# EAGLE design STM32-DIPDAP-v1.0.0 (EAGLE 7.7.0)
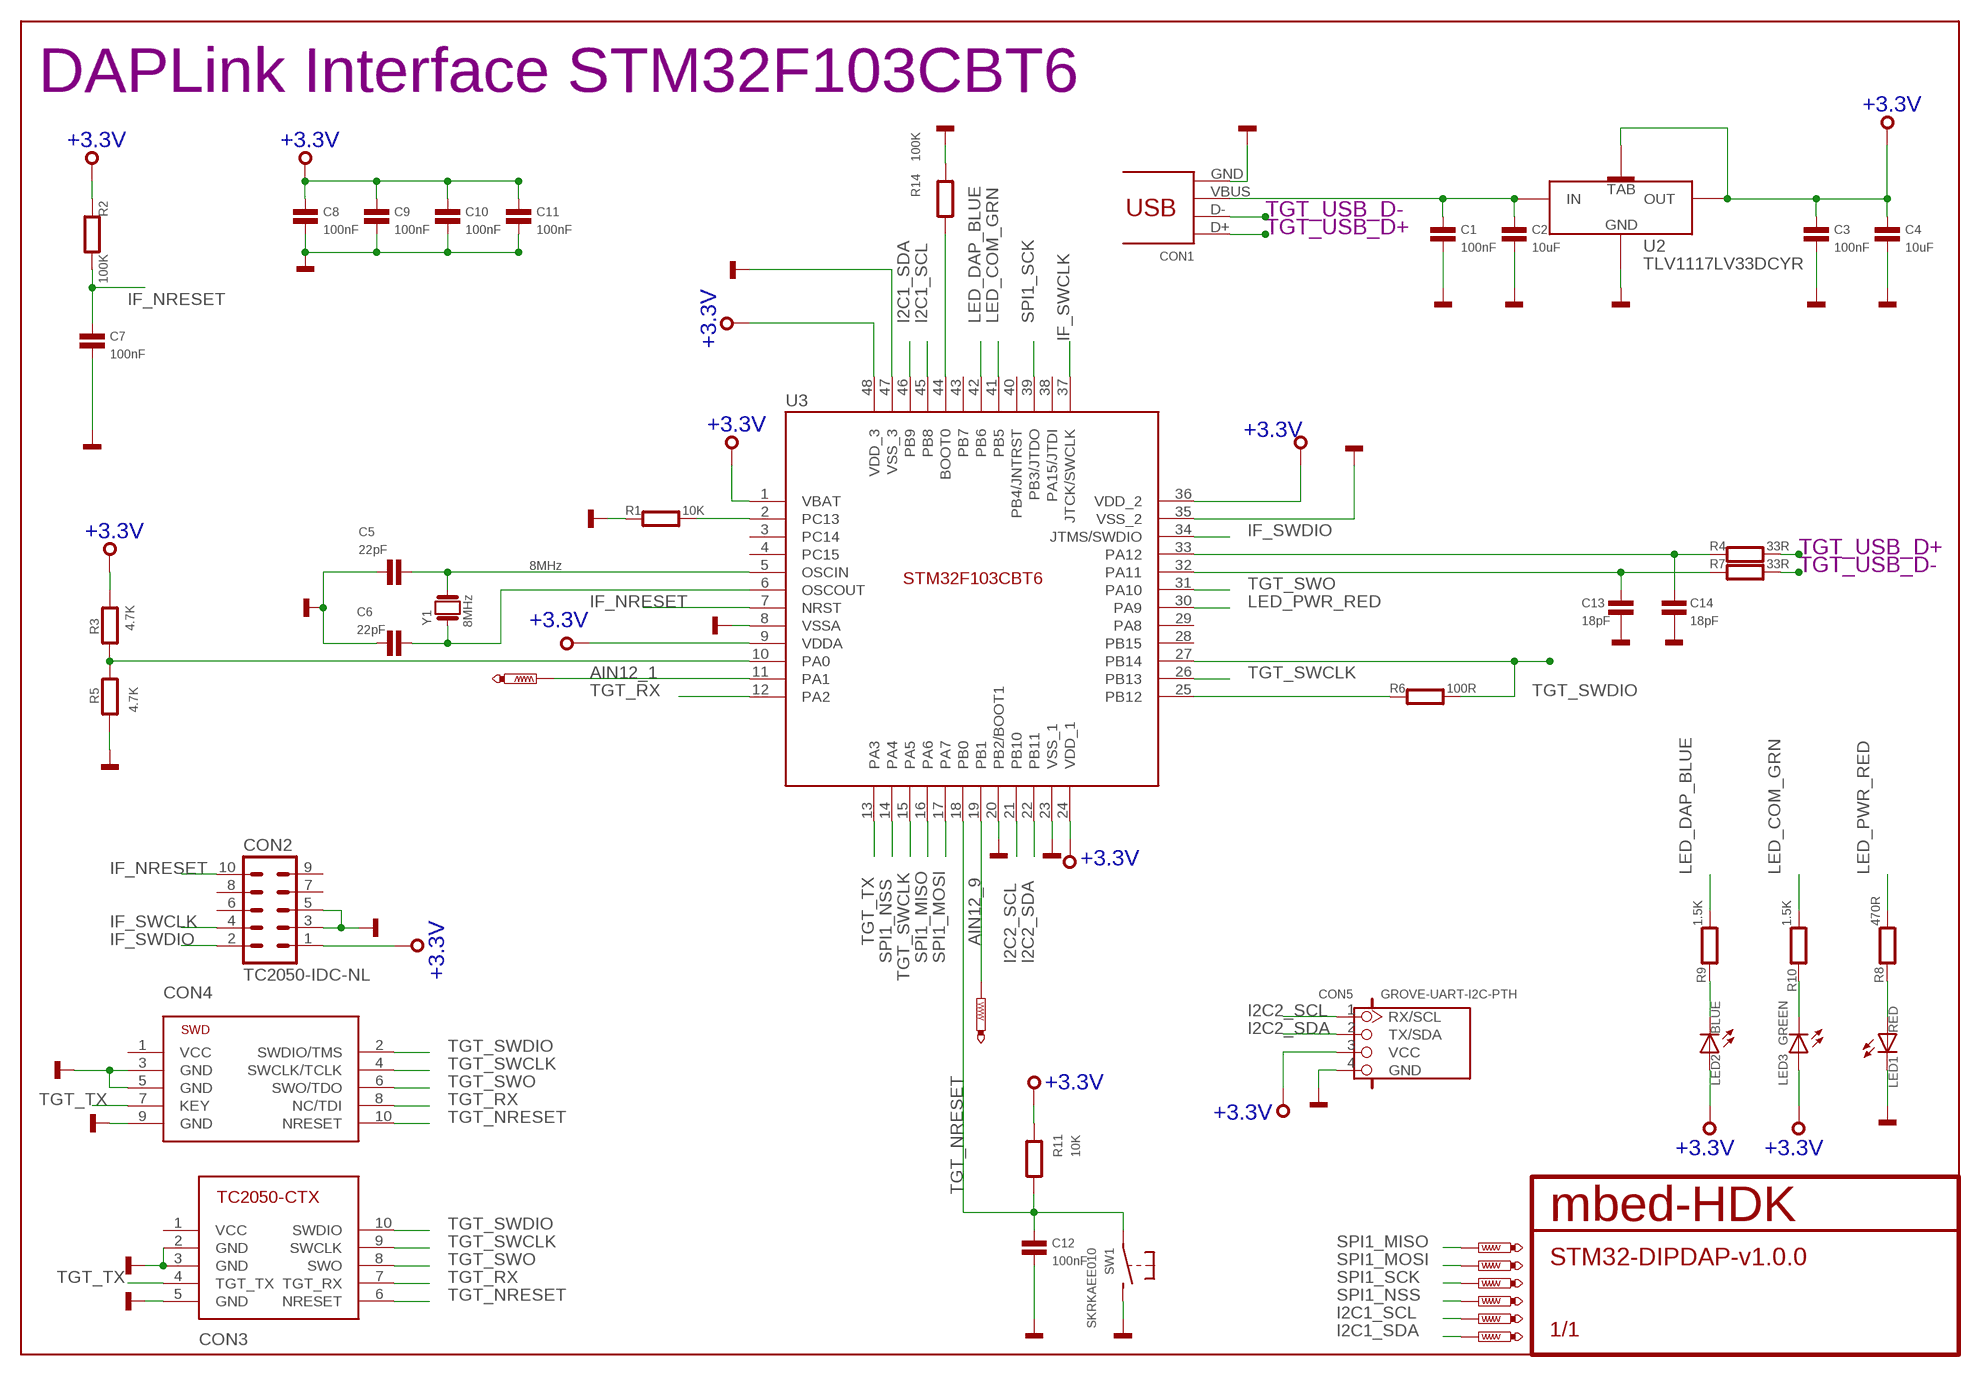
[diagram p0: schematic, sheet 1]

## Parts
C1  100nF  CAPACITOR0603  [0603]
C2  10uF  CAPACITOR0603  [0603]
C3  100nF  CAPACITOR0603  [0603]
C4  10uF  CAPACITOR0603  [0603]
C5  22pF  CAPACITOR0603  [0603]
C6  22pF  CAPACITOR0603  [0603]
C7  100nF  CAPACITOR0603  [0603]
C8  100nF  CAPACITOR0603  [0603]
C9  100nF  CAPACITOR0603  [0603]
C10  100nF  CAPACITOR0603  [0603]
C11  100nF  CAPACITOR0603  [0603]
C12  100nF  CAPACITOR0603  [0603]
C13  18pF  CAPACITOR0603  [0603]
C14  18pF  CAPACITOR0603  [0603]
CON1  47346-0001  [USB-MICRO-B-H]
CON2  TC2050-IDC-NL  [TC2050-IDC-NL]
CON3  TC-2050  [2X5_0.1"]
CON4  SWD-10-SMD  [SWD-10-SMD]
CON5  GROVE-UART-I2C-PTH  [HW4-2.0]
LED1  RED  SMD_LED0603  [CHIPLED_0603]
LED2  BLUE  SMD_LED0603  [CHIPLED_0603]
LED3  GREEN  SMD_LED0603  [CHIPLED_0603]
R1  10K  RESISTOR0603  [0603]
R2  100K  RESISTOR0603  [0603]
R3  4.7K  RESISTOR0603  [0603]
R4  33R  RESISTOR0603  [0603]
R5  4.7K  RESISTOR0603  [0603]
R6  100R  RESISTOR0603  [0603]
R7  33R  RESISTOR0603  [0603]
R8  470R  RESISTOR0603  [0603]
R9  1.5K  RESISTOR0603  [0603]
R10  1.5K  RESISTOR0603  [0603]
R11  10K  RESISTOR0603  [0603]
R14  100K  RESISTOR0603  [0603]
SW1  SKRKAEE010  [SKRKAEE010]
TP1  PTR1TP07R  [TP07R]
TP2  PTR1TP07R  [TP07R]
TP3  PTR1TP07R  [TP07R]
TP4  PTR1TP07R  [TP07R]
TP5  PTR1TP07R  [TP07R]
TP6  PTR1TP07R  [TP07R]
TP7  PTR1TP07R  [TP07R]
TP8  PTR1TP07R  [TP07R]
U2  TLV1117LV33DCYR  [SOT223]
U3  STM32F103CBT6  [LQFP48]
Y1  8MHz  GENERIC-CRYSTAL_2.5X2.0  [2.5X2.0]

## Nets
+3.3V: C3.1 C4.1 C8.1 C9.1 C10.1 C11.1 CON2.1 CON5.3(VCC) LED2.A LED3.A R2.1 R3.1 R11.1 U2.OUT(1)(OUT) U2.OUT(2)(TAB) U3.1(VBAT) U3.9(VDDA) U3.24(VDD_1) U3.36(VDD_2) U3.48(VDD_3)
AIN12_1: TP2.TP U3.11(PA1)
AIN12_9: TP1.TP U3.19(PB1)
GND: C1.2 C2.2 C3.2 C4.2 C5.2 C6.2 C7.2 C8.2 C9.2 C10.2 C11.2 C12.2 C13.2 C14.2 CON1.GND CON2.3 CON2.5 CON3.2(GND) CON3.3(GND) CON3.5(GND) CON4.3(GND) CON4.5(GND) CON4.9(GND) CON5.4(GND) LED1.C R1.1 R5.2 R14.1 SW1.P$2(S) U2.GND U3.8(VSSA) U3.20(PB2/BOOT1) U3.23(VSS_1) U3.35(VSS_2) U3.47(VSS_3)
I2C1_SCL: TP4.TP U3.45(PB8)
I2C1_SDA: TP3.TP U3.46(PB9)
I2C2_SCL: CON5.1(RX/SCL) U3.21(PB10)
I2C2_SDA: CON5.2(TX/SDA) U3.22(PB11)
IF_NRESET: C7.1 CON2.10 R2.2 U3.7(NRST)
IF_SWCLK: CON2.4 U3.37(JTCK/SWCLK)
IF_SWDIO: CON2.2 U3.34(JTMS/SWDIO)
LED_COM_GRN: R10.2 U3.41(PB5)
LED_DAP_BLUE: R9.2 U3.42(PB6)
LED_PWR_RED: R8.2 U3.30(PA9)
N$1: C1.1 C2.1 CON1.VBUS U2.IN
N$3: R14.2 U3.44(BOOT0)
N$4: R1.2 U3.2(PC13)
N$5: C6.1 U3.6(OSCOUT) Y1.1
N$6: C5.1 U3.5(OSCIN) Y1.3
N$8: R3.2 R5.1 U3.10(PA0)
N$11: LED1.A R8.1
N$12: R6.1 U3.25(PB12)
N$13: LED2.C R9.1
N$14: LED3.C R10.1
N$15: C14.1 R4.1 U3.33(PA12)
N$17: C13.1 R7.1 U3.32(PA11)
SPI1_MISO: TP8.TP U3.16(PA6)
SPI1_MOSI: TP7.TP U3.17(PA7)
SPI1_NSS: TP5.TP U3.14(PA4)
SPI1_SCK: TP6.TP U3.39(PB3/JTDO)
TGT_NRESET: C12.1 CON3.6(NRESET) CON4.10(NRESET) R11.2 SW1.P$1(P) U3.18(PB0)
TGT_RX: CON3.7(TGT_RX) CON4.8(NC/TDI) U3.12(PA2)
TGT_SWCLK: CON3.9(SWCLK) CON4.4(SWCLK/TCLK) U3.15(PA5) U3.26(PB13)
TGT_SWDIO: CON3.10(SWDIO) CON4.2(SWDIO/TMS) R6.2 U3.27(PB14)
TGT_SWO: CON3.8(SWO) CON4.6(SWO/TDO) U3.31(PA10)
TGT_TX: CON3.4(TGT_TX) CON4.7(KEY) U3.13(PA3)
TGT_USB_D+: CON1.D+ R4.2
TGT_USB_D-: CON1.D- R7.2
Unconnected: CON2.6 CON2.7 CON2.8 CON2.9 CON3.1(VCC) CON4.1(VCC) U3.3(PC14) U3.4(PC15) U3.28(PB15) U3.29(PA8) U3.38(PA15/JTDI) U3.40(PB4/JNTRST) U3.43(PB7)

## Notes on the sheet
- DAPLink Interface STM32F103CBT6
- 8MHz

## Library data of the parts
C1 C3 C7-C12 = mbed-HDK-RLCQ:CAPACITOR: Capacitor
C2 C4-C6 C13 C14 = mbed-HDK-RLC:CAPACITOR: Capacitor
CON1 = mbed-HDK-Connector:47346-0001: USB Receptacle Horizontal Micro Type B; MF: MOLEX; MFN: 47346-0001; OC-MOUSER: 538-47346-0001; OC-NEWARK: 1568026
CON2 = mbed-HDK-Connector:TC2050-IDC: Tag-Connect In Circuit Programming & Debug Cable 10 Pin
CON3 = mbed-HDK-Connector:TC-2050: 2.54mm pitch TC2050
CON4 = mbed-HDK-Connector:SWD-10: 2.54mm pitch 10-Pin Cortex Programming Header
CON5 = blackbriar:GROVE-UART-I2C-PTH
LED1-LED3 = mbed-HDK-Optical:SMD_LED: LED SMD, Colour Red; MF: Wurth Electronics Inc; MFN: 150060RS75000; OC-DIGIKEY: 732-4978-1-ND; OC-MOUSER: 710-150060RS75000; OC-NEWARK: 2322071
R1 R4 R6 R7 = mbed-HDK-RLC:RESISTOR: Resistor
R2 R3 R5 R8-R11 R14 = mbed-HDK-RLCQ:RESISTOR: Resistor
SW1 = mbed-HDK-Switch:SKRKAEE010: MOMENTARY SWITCH PUSH VERTICAL (SPST); MF: ALPS; MFN: SKRKAEE010; OC-MOUSER: 688-SKRKAE
TP1-TP8 = blackbriar:PTR1: TEST PIN
U2 = mbed-HDK-Power:TLV1117LV33DCYR: LDO Fixed Regulator 3.3v, 1A; MF: Texas Instruments; MFN: TLV1117LV33DCYR; OC-DIGIKEY: 296-28778-1-ND; OC-MOUSER: 595-TLV1117LV33DCYR; OC-NEWARK: 2323647
U3 = mbed-HDK-MF-ST:STM32F103CBT6: ARM® Cortex®-M3 STM32 F1 Microcontroller IC 32-Bit 72MHz 128KB (128K x 8) FLASH; MF: STMicroelectronics; MFN: STM32F103CBT6; OC-DIGIKEY: 497-6288-ND; OC-MOUSER: 511-STM32F103CBT6; OC-NEWARK: 11N8296
Y1 = mbed-HDK-Oscillator:GENERIC-CRYSTAL: GENERIC Crystal

## Board
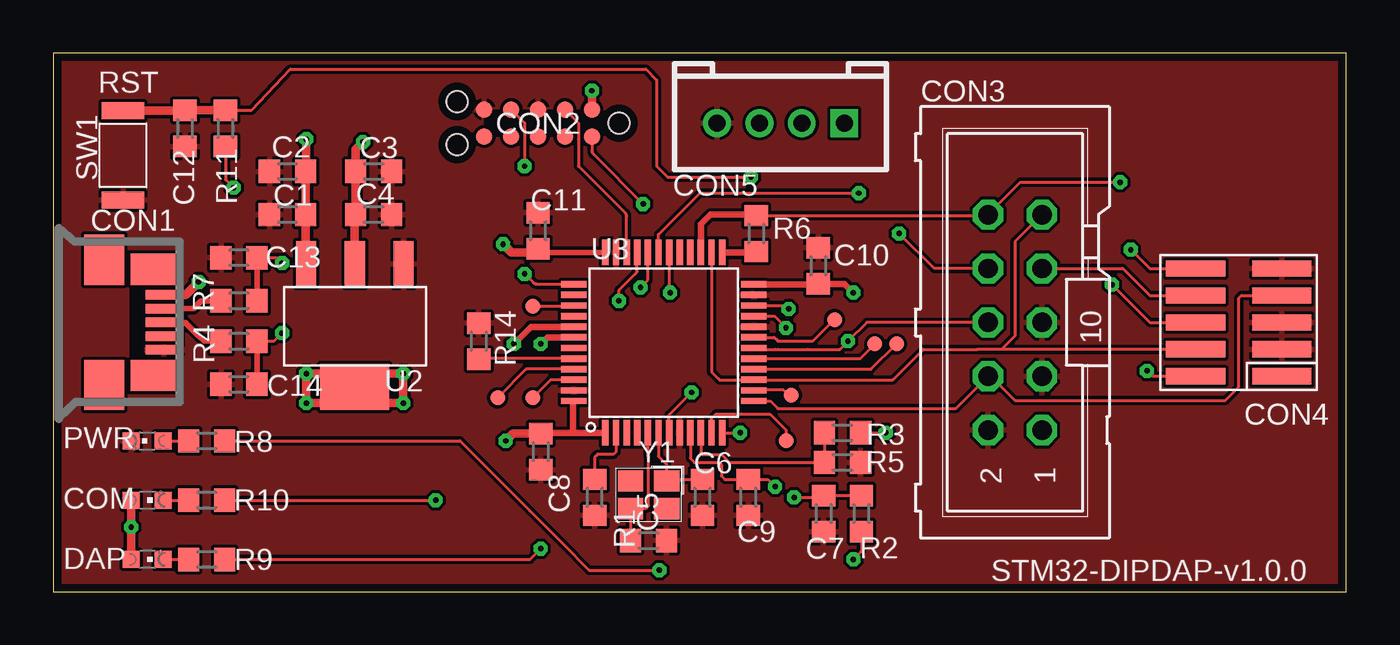
[diagram p1: board, top side]
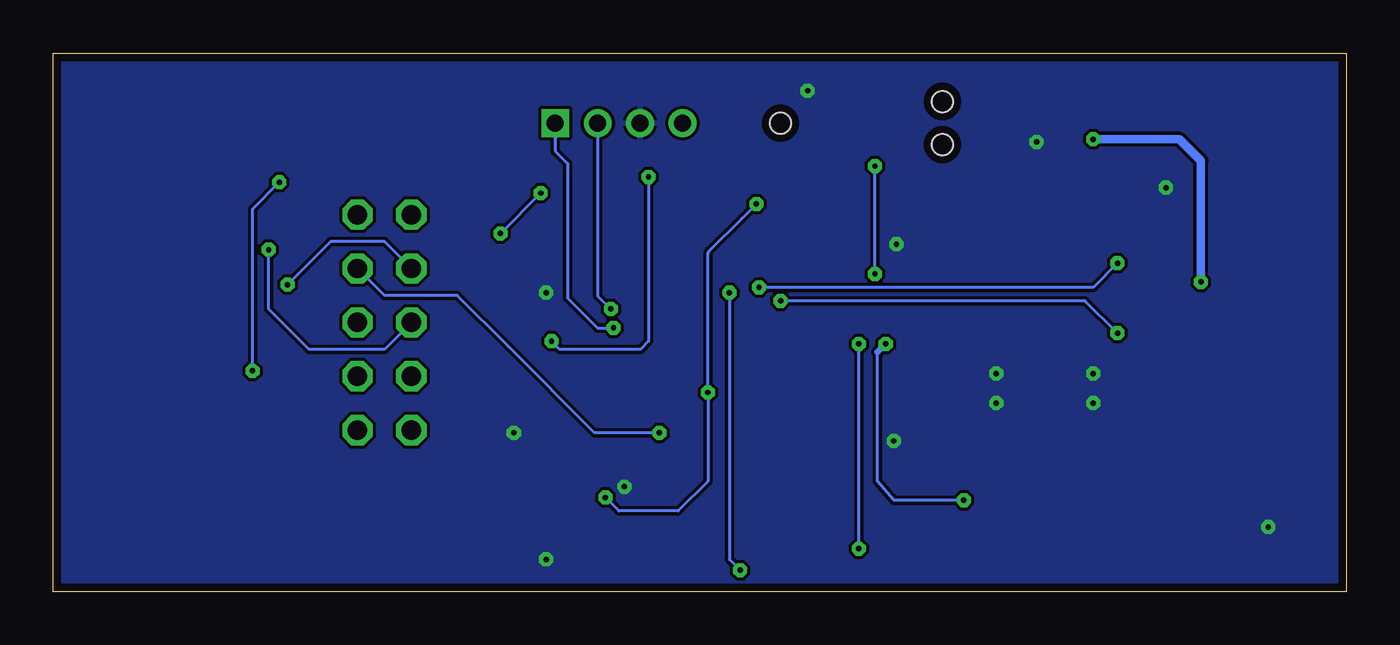
[diagram p2: board, bottom side, seen from below]

Size 60.96 x 25.4 mm. Coordinates in mm from the lower left corner, seen from the top.
Outline: 0,0 60.96,0 60.96,25.4 0,25.4 0,0
Copper layers ((1*16)): Top 0.035mm / dielectric 0.8mm / Bottom 0.035mm
Design rules "mbed-HDK-6-6-2-layer *": minimum track width 6mil, minimum drill 9mil, track to track 6mil, track to pad 6mil, pad to pad 6mil, via to via 6mil, smd to smd 6mil, copper to edge 15mil, drill to drill 8mil, minimum pad ring 10mil, minimum via ring 8mil, stop-mask expansion 4mil, vias tented up to drill 0mil, thermal gap 6mil

### Footprints (pad centres in the part's own frame; a part is rotated, then mirrored left to right if it is on the bottom)
0603 = smd 1 x 1.1: 1 -0.85,0; 2 0.85,0
USB-MICRO-B-H = smd 1.7 x 0.45: 4 2.8,-0.65; D+ 2.8,0; D- 2.8,0.65; GND 2.8,-1.3; VBUS 2.8,1.3 | smd 1.9 x 2.375: GND1 0,2.95; GND4 0,-2.95 | smd 2.1 x 1.475: GND2 2.3,2.5; GND3 2.3,-2.5
TC2050-IDC-NL = smd 0.787 x 0.787: 1 -2.54,-0.635; 2 -1.27,-0.635; 3 0,-0.635; 4 1.27,-0.635; 5 2.54,-0.635; 6 2.54,0.635; 7 1.27,0.635; 8 0,0.635; 9 -1.27,0.635; 10 -2.54,0.635 | hole 0.991: -3.81,0; 3.81,1.016; 3.81,-1.016
2X5_0.1" = drill 0.914 octagon: 1 -5.08,-1.27; 2 -5.08,1.27; 3 -2.54,-1.27; 4 -2.54,1.27; 5 0,-1.27; 6 0,1.27; 7 2.54,-1.27; 8 2.54,1.27; 9 5.08,-1.27; 10 5.08,1.27
SWD-10-SMD = smd 0.762 x 2.794: 1 0.381,-2.032; 2 0.381,2.032; 3 1.651,-2.032; 4 1.651,2.032; 5 2.921,-2.032; 6 2.921,2.032; 7 4.191,-2.032; 8 4.191,2.032; 9 5.461,-2.032; 10 5.461,2.032
HW4-2.0 = drill 0.8 pad 1.27 square: 1 -3,0 | drill 0.8 pad 1.27: 2 -1,0; 3 1,0; 4 3,0
CHIPLED_0603 = smd 0.8 x 0.8: A 0,-0.75; C 0,0.75
SKRKAEE010 = smd 0.8 x 2: P$1 -2.1,0; P$2 2.1,0
TP07R = smd 0.7 x 0.7: TP 0,0
SOT223 = smd 0.95 x 2.15: GND -2.3,-5.8; IN 2.3,-5.8; OUT(1) 0,-5.8 | smd 3.25 x 2.15: OUT(2) 0,0
LQFP48 = smd 0.3 x 1.2: 1 0,0; 2 0.5,0; 3 1,0; 4 1.5,0; 5 2,0; 6 2.5,0; 7 3,0; 8 3.5,0; 9 4,0; 10 4.5,0; 11 5,0; 12 5.5,0; 25 5.5,8.5; 26 5,8.5; 27 4.5,8.5; 28 4,8.5; 29 3.5,8.5; 30 3,8.5; 31 2.5,8.5; 32 2,8.5; 33 1.5,8.5; 34 1,8.5; 35 0.5,8.5; 36 0,8.5 | smd 1.2 x 0.3: 13 7,1.5; 14 7,2; 15 7,2.5; 16 7,3; 17 7,3.5; 18 7,4; 19 7,4.5; 20 7,5; 21 7,5.5; 22 7,6; 23 7,6.5; 24 7,7; 37 -1.5,7; 38 -1.5,6.5; 39 -1.5,6; 40 -1.5,5.5; 41 -1.5,5; 42 -1.5,4.5; 43 -1.5,4; 44 -1.5,3.5; 45 -1.5,3; 46 -1.5,2.5; 47 -1.5,2; 48 -1.5,1.5
2.5X2.0 = smd 1.2 x 1: 1 -0.85,-0.65; 2 0.85,-0.65; 3 0.85,0.65; 4 -0.85,0.65

### Placement (x,y rotation side)
C1  11.05,17.78 180 top
C2  11.05,19.81 180 top
C3  15.11,19.81 0 top
C4  15.11,17.78 0 top
C5  28.07,2.41 0 top
C6  30.61,4.44 270 top
C7  36.32,3.68 270 top
C8  22.99,6.6 270 top
C9  32.77,4.44 270 top
C10  36.07,15.37 90 top
C11  22.86,17.02 90 top
C12  6.22,21.84 270 top
C13  8.76,15.75 180 top
C14  8.76,9.78 180 top
CON1  2.41,12.7 0 top
CON2  22.86,22.1 180 top
CON3  45.34,12.7 90 top
CON4  55.88,9.78 90 top
CON5  34.29,22.1 180 top
LED1  4.45,7.11 90 top
LED2  4.45,1.52 270 top
LED3  4.45,4.32 270 top
R1  25.53,4.44 90 top
R2  38.1,3.68 90 top
R3  37.21,7.49 180 top
R4  8.76,11.81 180 top
R5  37.21,6.1 0 top
R6  33.15,16.89 90 top
R7  8.76,13.72 180 top
R8  7.24,7.11 0 top
R9  7.24,1.52 0 top
R10  7.24,4.32 0 top
R11  8.13,21.84 90 top
R14  20.07,11.81 270 top
SW1  3.3,20.57 270 top
TP1  36.83,12.83 0 top
TP2  34.54,7.11 0 top
TP3  22.61,9.14 0 top
TP4  20.95,9.14 0 top
TP5  34.8,9.27 0 top
TP6  22.61,13.46 0 top
TP7  38.73,11.68 0 top
TP8  39.75,11.68 0 top
U2  14.22,9.65 180 top
U3  26.04,7.49 0 top
Y1  28.07,4.57 180 top

### Tracks (layer width: path | path; a pad name or v marks a point on that pad's centre or on a via)
+3.3V  (via drill 0.25)
  Top 0.152: U3.9 30.04,6.29 30.23,6.1 31.37,6.1 31.5,5.97 31.5,5.46 31.62,5.33 31.66,5.29 C9.1 33.69,5.29 v34.04,4.95 | R2.1 38.1,1.9 v37.72,1.52 | 23.03,7.49 C8.1 | R11.1 8.13,19.43 v8.51,19.05 | R3.1 v39.24,7.49
  Top 0.254: U3.36 23.04,15.99 C11.1
  Top 0.305: U3.24 36.04,14.49 C10.1 37.3,14.52 v37.72,14.1 | 23.04,15.99 C11.1 | 23.03,7.49 24.51,7.49 | 24.51,7.49 U3.1 | U3.48 24.51,8.97 24.51,7.49
  Top 0.406: U2.OUT(1) 14.22,17.74 C4.1 C3.1 14.26,20.87 v14.61,21.21 | v11.94,10.29 v16.51,10.29 v16.51,8.89 v11.94,8.89 v11.94,10.29 | v11.94,10.29 13.59,10.29 U2.OUT(2) | CON2.1 v25.4,23.62 | LED3.A 3.69,3.06 v3.68,3.05 3.69,3.04 LED2.A | v21.34,7.11 21.68,7.45 C8.1 | 23.04,15.99 21.6,15.99 v21.21,16.38
  pour Bottom: 0,0 60.96,0 60.96,25.4 0,25.4
AIN12_1
  Top 0.152: U3.11 31.04,8.17 31.24,8.38 33.78,8.38 34.54,7.62 TP2.TP
AIN12_9
  Top 0.152: U3.19 33.98,11.99 34.16,11.81 35.81,11.81 TP1.TP
GND
  pour Top: 0,25.4 0,0 60.96,0 60.96,25.4
I2C1_SCL
  Top 0.152: U3.45 22.3,10.49 TP4.TP
I2C1_SDA
  Top 0.152: U3.46 23.45,9.99 TP3.TP
I2C2_SCL  (via drill 0.25)
  Top 0.152: U3.21 34,12.99 v34.54,12.45
  Bottom 0.152: CON5.1 37.29,20.78 36.7,20.19 36.7,14.35 36.7,13.84 35.56,12.7 35.31,12.45 v34.54,12.45
I2C2_SDA  (via drill 0.25)
  Top 0.152: U3.22 34.51,13.49 v34.67,13.33
  Bottom 0.152: CON5.2 35.29,13.95 v34.67,13.33
IF_NRESET  (via drill 0.25)
  Top 0.152: U3.7 29.04,8.33 v30.1,9.4 | v34.92,4.44 36.23,4.44 C7.1 R2.2 | CON2.10 25.4,20.81 arc45 25.47,20.63 v27.81,18.29
  Bottom 0.152: v34.92,4.44 34.29,3.81 31.5,3.81 30.1,5.21 v30.1,9.4 30.1,15.9 arc45 30.02,16.08 28.5,17.6 v27.81,18.29
IF_SWCLK  (via drill 0.25)
  Top 0.152: CON2.4 22.23,22.1 v22.23,20.07 | U3.37 22.82,14.49 arc-45 22.64,14.57 v22.23,14.99
  Bottom 0.152: v22.23,14.99 v22.23,20.07
IF_SWDIO
  Top 0.152: CON2.2 24.77,22.1 24.77,21.34 24.77,20.07 26.96,17.87 arc-45 27.04,17.69 U3.34
LED_COM_GRN  (via drill 0.25)
  Top 0.152: R10.2 v18.03,4.32
  Top 0.305: U3.41 22.53,12.49 v21.72,11.68
  Bottom 0.152: v18.03,4.32 21.34,4.32 22.1,5.21 22.1,11.3
  Bottom 0.305: 22.1,11.3 v21.72,11.68
LED_DAP_BLUE  (via drill 0.25)
  Top 0.152: R9.2 22.48,1.52 v22.99,2.03
  Top 0.305: U3.42 23.3,11.99 v22.99,11.68
  Bottom 0.152: v22.99,2.03 v22.99,11.68
LED_PWR_RED  (via drill 0.25)
  Top 0.152: R8.2 19.18,7.11 22.48,3.81 24,2.29 25.27,1.02 v28.57,1.02 | U3.30 29.04,14.4 v29.08,14.1
  Bottom 0.152: v29.08,14.1 29.08,1.52 v28.57,1.02
N$1  (via drill 0.25)
  Top 0.406: CON1.VBUS 6.25,14 v6.86,14.6 | 11.94,15.44 U2.IN 11.9,15.48 C1.1 C2.1 11.94,20.23 v11.94,21.34
  Bottom 0.406: v6.86,14.6 6.86,20.32 7.87,21.34 v11.94,21.34
N$3
  Top 0.152: U3.44 20.1,10.99
  Top 0.305: 20.1,10.99 R14.2
N$4
  Top 0.152: U3.2 26.54,6.6 26.42,6.48 25.65,6.48 25.53,6.35 R1.2
N$5
  Top 0.152: U3.6 28.54,6.39 28.83,6.1 28.92,6.01 Y1.1 28.99,5.29 C6.1
N$6
  Top 0.152: C5.1 Y1.3 27.23,3.94 27.94,3.94 28.07,4.06 28.07,6.35 28.04,6.38 U3.5
N$8
  Top 0.152: U3.10 30.54,6.55 30.61,6.48 31.5,6.48 31.88,6.1 35.43,6.1 R5.1 R3.2
N$11
  Top 0.152: LED1.A R8.1
N$12
  Top 0.305: U3.25 33.1,15.99 R6.1
N$13
  Top 0.152: LED2.C R9.1
N$14
  Top 0.152: LED3.C R10.1
N$15  (via drill 0.25)
  Top 0.152: R4.1 10.41,11.81 v10.79,12.19 | v26.67,13.72 26.67,14.22 27.43,14.99 27.54,15.09 U3.33
  Top 0.254: C14.1 R4.1
  Bottom 0.152: v10.79,12.19 12.32,13.72 v26.67,13.72
N$17  (via drill 0.25)
  Top 0.152: C13.1 10.54,15.75 v10.79,15.49 | v27.69,14.35 28.04,14.7 U3.32
  Top 0.254: R7.1 C13.1
  Bottom 0.152: v10.79,15.49 11.94,14.35 v27.69,14.35
SPI1_MISO
  Top 0.152: U3.16 38.56,10.49 TP8.TP
SPI1_MOSI
  Top 0.152: U3.17 35.36,10.99 36.63,10.99 38.04,10.99 TP7.TP
SPI1_NSS
  Top 0.152: TP5.TP 34.67,9.27 34.42,9.52 33.07,9.52 U3.14
SPI1_SCK
  Top 0.152: TP6.TP 24.5,13.46 U3.39
TGT_NRESET  (via drill 0.25)
  Top 0.152: R11.2 9.06,22.69 9.36,22.69 11.18,24.64 27.94,24.64 28.45,24.13 28.45,20.07 28.96,19.56 v32.89,19.56 | CON3.6 38.35,12.7 v37.47,11.81 37.08,11.43 35.56,11.43 34.16,11.43 34.04,11.43 33.1,11.43 U3.18 | v50.8,16.13 51.69,15.24 CON4.10
  Top 0.406: SW1.P$1 6.2,22.67 C12.1 R11.2
  Bottom 0.152: v32.89,19.56 32.89,12.45 32.89,11.81 33.27,11.43 37.08,11.43 v37.47,11.81 | CON3.6 45.34,11.43 48.9,11.43 50.8,13.33 v50.8,16.13
TGT_RX  (via drill 0.25)
  Top 0.152: U3.12 v32.38,7.49 | CON3.7 50.42,15.24 51.69,13.97 CON4.8
  Bottom 0.152: v32.38,7.49 35.43,7.49 39.5,11.56 41.91,13.97 42.93,13.97 45.34,13.97 CON3.7
TGT_SWCLK
  Top 0.152: U3.26 31.04,10.37 31.37,10.03 31.41,9.99 U3.15 39.58,9.99 41.02,11.43 43.56,11.43 44.7,11.43 | CON3.9 45.34,16.51 45.34,12.7 45.34,12.06 44.7,11.43 | CON4.4 44.7,11.43
TGT_SWDIO  (via drill 0.25)
  Top 0.152: R6.2 44.03,17.74 CON3.10 45.59,19.3 v50.29,19.3 | CON4.2 51.82,10.16 v51.56,10.41
  Top 0.305: U3.27 30.54,17.33 30.99,17.78 33.11,17.78 R6.2
  Bottom 0.152: v51.56,10.41 51.56,18.03 v50.29,19.3
TGT_SWO  (via drill 0.25)
  Top 0.152: U3.31 28.54,16.85 30.48,18.8 v37.97,18.8 | CON3.8 41.53,15.24 v39.88,16.89 | v49.91,14.48 51.69,12.7 CON4.6
  Bottom 0.152: v37.97,18.8 v39.88,16.89 | CON3.8 45.34,16.51 47.88,16.51 v49.91,14.48
TGT_TX
  Top 0.152: U3.13 33.81,8.99 34.16,8.64 42.55,8.64 42.93,9.02 | 42.93,9.02 42.9,8.99 42.93,9.02 | 42.93,9.02 CON3.4 44.2,10.16 45.34,9.02 55.24,9.02 55.88,9.65 55.88,13.84 56.01,13.97 CON4.7
TGT_USB_D+
  Top 0.254: CON1.D+ 6.22,12.7 6.86,12.06 7.11,11.81 R4.2
TGT_USB_D-
  Top 0.254: CON1.D- 6.62,13.35 6.99,13.72 R7.2

### Text on the board
tPlace: RST | PWR | COM | DAP | STM32-DIPDAP-v1.0.0